# Altium schematic sheet PCB_Proyecto_Analoga.SchDoc
size A4; SheetNumber: 1; SheetTotal: 1
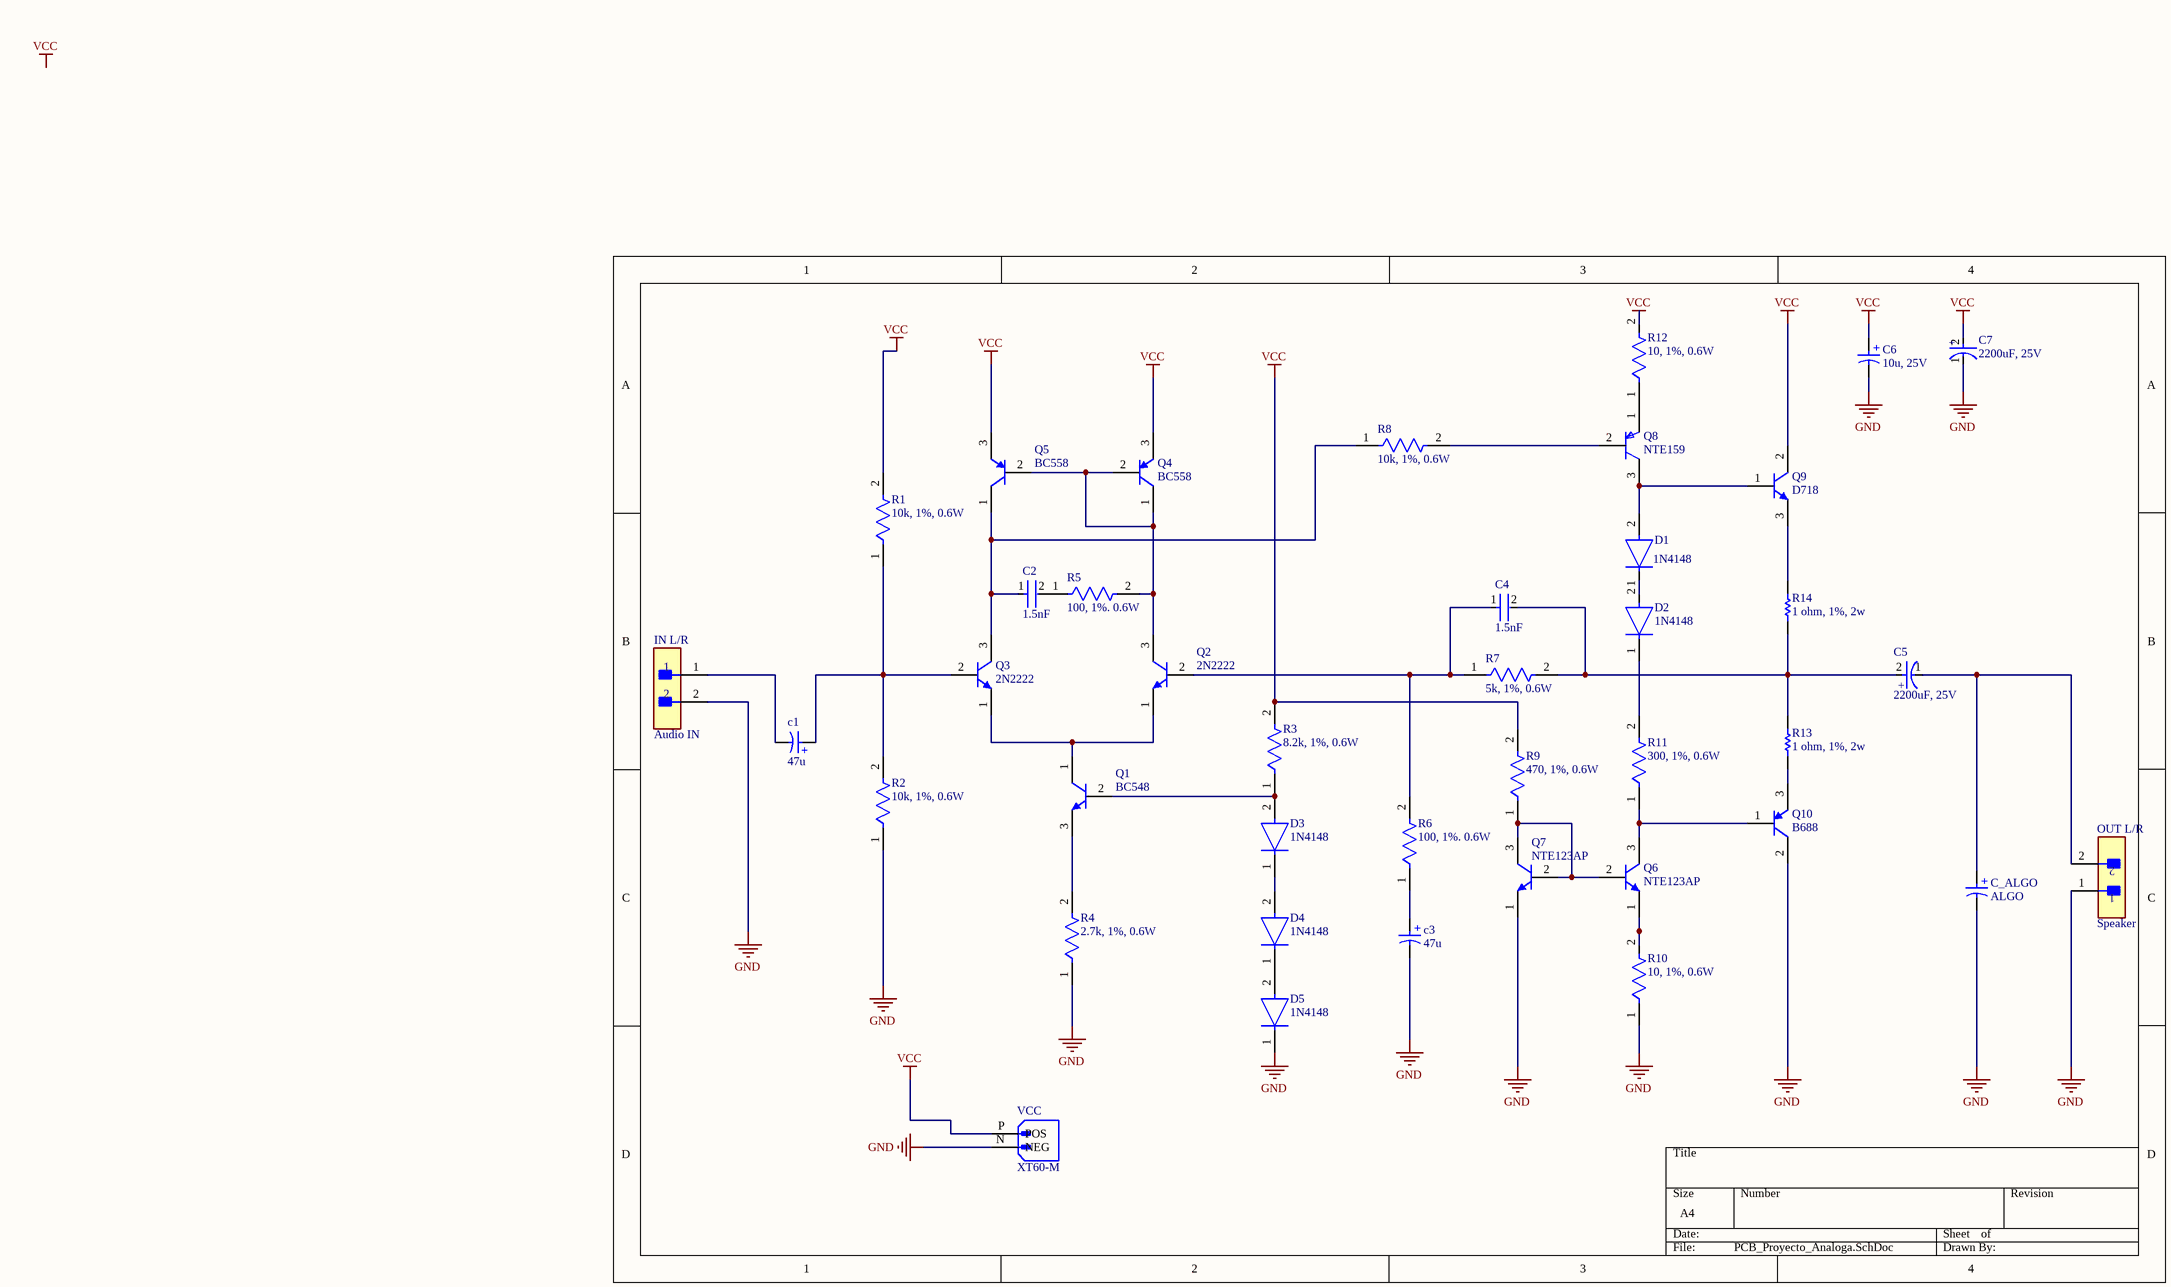
[diagram p0: PCB_Proyecto_Analoga.SchDoc]

## Parts
c1  47u  [WCAP-ATG5_D5H11]
C2  1.5nF  [FP-K105Z20Y5VF5TL2-MFG]
c3  47u  [WCAP-ATG5_D5H11]
C4  1.5nF  [FP-K105Z20Y5VF5TL2-MFG]
C5  2200uF, 25V  [FP-RAD-TH-D_12_5_0_5-L_35-MFG]
C6  10u, 25V  [WCAP-ATG5_D5H11]
C7  2200uF, 25V  [FP-RAD-TH-D_12_5_0_5-L_35-MFG]
C_ALGO  ALGO  [WCAP-ATG5_D5H11]
D1  1N4148  [FP-DO-35-MFG]
D2  1N4148  [FP-DO-35-MFG]
D3  1N4148  [FP-DO-35-MFG]
D4  1N4148  [FP-DO-35-MFG]
D5  1N4148  [FP-DO-35-MFG]
IN_L/R  Audio IN  [FP-22-28-8020-MFG]
OUT_L/R  Speaker  [FP-22-28-8020-MFG]
Q1  BC548  [ONSC-TO-92-3-29-11_AM_BL]
Q2  2N2222  [FAIR-TO-92-3]
Q3  2N2222  [FAIR-TO-92-3]
Q4  BC558  [ONSC-TO-92-3-29-11_AM_BL]
Q5  BC558  [ONSC-TO-92-3-29-11_AM_BL]
Q6  NTE123AP  [FAIR-TO-92-3]
Q7  NTE123AP  [FAIR-TO-92-3]
Q8  NTE159  [FP-135AR-MFG]
Q9  D718  [ONSC-TO-3P-3LD-3-340AB-01]
Q10  B688  [ONSC-TO-3P-3LD-3-340AB-01]
R1  10k, 1%, 0.6W  [FP-MF0207-MFG]
R2  10k, 1%, 0.6W  [FP-MF0207-MFG]
R3  8.2k, 1%, 0.6W  [FP-MRS25-MFG]
R4  2.7k, 1%, 0.6W  [FP-MF0207-MFG]
R5  100, 1%. 0.6W  [FP-MRS25-MFG]
R6  100, 1%. 0.6W  [FP-MRS25-MFG]
R7  5k, 1%, 0.6W  [FP-MF0207-MFG]
R8  10k, 1%, 0.6W  [FP-MF0207-MFG]
R9  470, 1%, 0.6W  [FP-MRS25-MFG]
R10  10, 1%, 0.6W  [FP-MRS25-MFG]
R11  300, 1%, 0.6W  [FP-MF0207-MFG]
R12  10, 1%, 0.6W  [FP-MRS25-MFG]
R13  1 ohm, 1%, 2w  [RESA86-1060X240]
R14  1 ohm, 1%, 2w  [RESA86-1060X240]
VCC  XT60-M  [AMASS_XT60-M]

## Nets
GND: c3.2(N) C6.2(N) C7.1(C) C_ALGO.2(N) D5.1(C) IN_L/R.2 OUT_L/R.1 Q7.1(E) Q10.2(C) R2.1 R4.1 R10.1 VCC.N(NEG)
VCC: C6.1(P) C7.2(A) Q4.3(E) Q5.3(E) Q9.2(C) R1.2 R3.2 R9.2 R12.2 VCC.P(POS)
Netc1_1: c1.1(P) Q3.2(B) R1.1 R2.2
Netc1_2: c1.2(N) IN_L/R.1
NetC2_1: C2.1 Q3.3(C) Q5.1(C) R8.1
NetC2_2: C2.2 R5.1
Netc3_1: c3.1(P) R6.1
NetC4_1: C4.1 Q2.2(B) R6.2 R7.1
NetC4_2: C4.2 C5.2(A) R7.2 R13.2 R14.1
NetC5_1: C5.1(C) C_ALGO.1(P) OUT_L/R.2
NetD1_1: D1.1(C) D2.2(A)
NetD1_2: D1.2(A) Q8.3(C) Q9.1(B)
NetD2_1: D2.1(C) R11.2
NetD3_1: D3.1(C) D4.2(A)
NetD3_2: D3.2(A) Q1.2(B) R3.1
NetD4_1: D4.1(C) D5.2(A)
NetQ1_1: Q1.1(C) Q2.1(E) Q3.1(E)
NetQ1_3: Q1.3(E) R4.2
NetQ2_3: Q2.3(C) Q4.1(C) Q4.2(B) Q5.2(B) R5.2
NetQ6_1: Q6.1(E) R10.2
NetQ6_2: Q6.2(B) Q7.2(B) Q7.3(C) R9.1
NetQ6_3: Q6.3(C) Q10.1(B) R11.1
NetQ8_1: Q8.1(E) R12.1
NetQ8_2: Q8.2(B) R8.2
NetQ9_3: Q9.3(E) R14.2
NetQ10_3: Q10.3(E) R13.1

## Notes on the sheet
- Labels drawn without touching a wire or pin: VCC
- (in symbol CMP-03913-53914185-1) +
- (in symbol CMP-05427-000597-1) +

## Library data of the parts
c1 c3 C_ALGO = CMP-03913-53914185-1: 860020472003 WCAP-ATG5 Aluminum Electrolytic Capacitors; Leakage Current: 3µA; Tolerance: 20%; Ripple Current: 38mA; Polarity: Polar; Voltage Rating: 25V; Pitch: 2mm; Capacitance: 10µF; Life (Hours): 2000hours; NexarPartId: 53914185; Min Operating Temperature: -40°C; Length: 11mm; Lead Pitch: 2.0066mm; Mount: Through Hole; Case/Package: Radial; RoHS: Compliant; Max Operating Temperature: 105°C; Diameter: 5mm; Packaging: Tape & Box (TB); Height - Seated (Max): 12.4968mm
C2 C4 = CMP-02417-000003-1: CAP CER 1UF 50V Y5V RADIAL; Manufacturer Part Number: K105Z20Y5VF5TL2; Manufacturer: Vishay BC Components; Tolerance: -20+80%; Material: Ceramic; Capacitance: 1uF; Temperature Characteristic: Y5V; Mouser Description: Multilayer Ceramic Capacitors MLCC - Leaded 1uF 50volts +80/-20% Y5V 2.5mm LS; Lead Free: Yes; RoHS: TRUE; Voltage Rating: 50V; Device Class L1: Passive Components; Octopart: https://octopart.com/k105z20y5vf5tl2-vishay-39475252; Temperature Range Low: -30°C; Digikey Description: CAP CER 1UF 50V Y5V RADIAL; Device Class L2: Capacitors; Temperature: -30°C to +85°C; Package: K105Z20Y5VF5TL2; Temperature Range High: +85°C; ComponentLink2Description: Datasheet; Value: 1uF; Category: Cap; Height: 6.6mm; ComponentLink2URL: https://www.vishay.com/docs/45171/kseries.pdf; Device Class L3: Ceramic Capacitors; Automotive: No
C5 C7 = CMP-05427-000597-1: Aluminum Electrolytic Capacitors (Radial Lead Type) AEC-Q200 Qualified 2200uF ±20% 25V; Lead Diameter: 0.8mm; Capacitance: 2.2mF; Leakage Current: 3uA; ESR (Equivalent Series Resistance): 22mR; Dielectric Material: Aluminium; Ripple Current: 2.51A; Life (Hours): 5000Hour; Termination: Radial; Voltage Rating: 25V; Package Quantity: 100; Lead Free: Lead Free; Contact Plating: Tin; Height - Seated (Max): 1.378inch; Mount: Through Hole; Height: 35mm; Max Operating Temperature: 105°C; Min Operating Temperature: -55°C; Voltage Rating (DC): 25V; Ratings: AEC-Q200; Packaging: Bulk; RoHS Compliant: Yes; Radiation Hardening: No; Lead Pitch: 5mm; Construction: RADIAL; Diameter: 12.5mm; Case/Package: Radial; REACH SVHC: No SVHC; Voltage: 25V; Tolerance: 20%; Impedance: 22mR; Length: 35mm; Series: FC
C6 = CMP-03913-53914185-1: 860020472003 WCAP-ATG5 Aluminum Electrolytic Capacitors; Leakage Current: 3µA; Tolerance: 20%; Ripple Current: 38mA; Polarity: Polar; Pitch: 2mm; Capacitance: 10µF; Life (Hours): 2000hours; NexarPartId: 53914185; Min Operating Temperature: -40°C; Length: 11mm; Lead Pitch: 2.0066mm; Mount: Through Hole; Voltage Rating: 25V; Case/Package: Radial; RoHS: Compliant; Max Operating Temperature: 105°C; Diameter: 5mm; Packaging: Tape & Box (TB); Height - Seated (Max): 12.4968mm
D1-D5 = CMP-06359-000016-1: DIODE GEN PURP 75V 200MA DO35
IN_L/R OUT_L/R = CMP-00257-00131383-2: 22-28-8020 Board Connector, 2 Contact(S), 1 Row(S), Male, Right Angle, 0.1 Inch Pitch, Solder Terminal,; NexarPartId: 131383; Manufacturer Lifecycle Status: ACTIVE; Voltage Rating: 250V; Number of Contacts: 2; Current Rating: 4A; Contact Resistance: 20mΩ; Max Voltage Rating (DC): 250.25kV; Glow Wire Compliant: Non-compliant; Pitch: 2.54mm; Plating: Tin; RoHS: Compliant; Lead Free: Lead Free; Termination: Through Hole; Height: 2.74mm; Contact Plating: Tin; Orientation: Right Angle; Min Operating Temperature: -40°C; Lifecycle Status: Production; Housing Material: Thermoplastic; Mount: Through Hole; Voltage Rating (DC): 250V; Gender: Male; Number of Rows: 1; Lead Pitch: 2.54mm; Packaging: Bulk; Number of Positions: 2; Flammability Rating: UL94 V-0; Number of Circuits: 2; Radiation Hardening: No; Housing Color: Black; Max Operating Temperature: 75°C; Color: Black; Contact Material: Brass; Country of Origin: US; REACH SVHC: Unknown
Q1 = CMP-1048-01603-1: Amplifier Transistor, NPN Silicon, 3-Pin TO-92, Pb-Free, Tape and Reel; Manufacturer: On Semiconductor; PartNumber: BC548BRL1G; fT Min (MHz): 150; IC Continuous (A): 0.1; ComponentLink3Description: Package Specification; ComponentLink1Description: Manufacturer URL; Packing: Tape and Reel; ComponentLink1URL: http://www.onsemi.com/; PackageReference: TO-92-3-29-11_AM_BL; Polarity: NPN; ComponentLink3URL: http://www.onsemi.com/pub_link/Collateral/MAC97-D.PDF; DatasheetVersion: Rev. 7; PackageDescription: 3-Pin Transistor Outline, Body 4.825 x 3.685 mm, Pitch 1.27 mm; ComponentLink2Description: Datasheet; Mounting Technology: Through Hole; PackageVersion: Rev. AM; RoHS: TRUE; ComponentLink2URL: http://www.onsemi.com/pub_link/Collateral/BC546-D.PDF
Q2 Q3 Q6 Q7 = CMP-2000-06911-1: NPN General-Purpose Amplifier, 40 V, -55 to 150 degC, 3-Pin TO-92, RoHS, Tape and Reel; Manufacturer: FairchildSemiconductor; Configuration: Single; Collector-Emitter Saturation Voltage: 1V; Collector- Emitter Voltage VCEO Max: 40V; Unit Weight: 0.008466oz; Maximum DC Collector Current: 1A; DC Collector/Base Gain hfe Min: 100; Emitter- Base Voltage VEBO: 6V; Maximum Power Dissipation: 625mW; DC Current Gain hFE Max: 300; Gain Bandwidth Product fT: 300MHz; Collector- Base Voltage VCBO: 75V; Mounting Style: ThroughHole; Package Description: 3-Pin Transistor Outline Package, Body Dia 4.79 mm, Pitch 2.6 mm; Mounting Technology: ThroughHole; RoHS: Details; Brand: FairchildSemiconductor; Minimum Operating Temperature: -55C; Package / Case: TO-92-3KinkedLead; Package Reference: TO-92; Series: PN2222; Packaging: Reel; Datasheet Version: Rev. 1.1.0, 07/2014; Datasheet URL: https://www.fairchildsemi.com/datasheets/PN/PN2222A.pdf; Maximum Operating Temperature: +150C; Transistor Polarity: NPN; Factory Pack Quantity: 2000; Manufacturer URL: https://www.fairchildsemi.com/; <PCN>: http://www.mouser.com/PCN/3.26.10LTBDFairchild.pdf; Product Category: BipolarTransistors-BJT
Q4 Q5 = CMP-1048-01513-1: Amplifier Transistor, PNP Silicon, 3-Pin TO-92, Pb-Free, Tape and Reel; Manufacturer: On Semiconductor; PartNumber: BC558BRL1G; IC Continuous (A): -0.1; ComponentLink1Description: Manufacturer URL; PackageReference: TO-92-3-29-11_AM_BL; ComponentLink3URL: http://www.onsemi.com/pub_link/Collateral/MAC97-D.PDF; ComponentLink1URL: http://www.onsemi.com/; Polarity: PNP; ComponentLink2Description: Datasheet; PackageDescription: 3-Pin Transistor Outline, Body 4.825 x 3.685 mm, Pitch 1.27 mm; ComponentLink2URL: http://www.onsemi.com/pub_link/Collateral/BC556B-D.PDF; DatasheetVersion: Rev. 3; ComponentLink3Description: Package Specification; Packing: Tape and Reel; RoHS: TRUE; Mounting Technology: Through Hole; PackageVersion: Rev. AM
Q8 = CMP-00278-84408866-1: 2N3906TF Small Signal Bipolar Transistor, 0.2A I(C), 40V V(BR)CEO, 1-Element, PNP, Silicon, TO-92; Manufacturer Lifecycle Status: ACTIVE; Collector Base Voltage (VCBO): -40V; Frequency: 250MHz; Number of Elements: 1; Max Power Dissipation: 625mW; Max Breakdown Voltage: 160V; Current Rating: -200mA; Emitter Base Voltage (VEBO): -5V; Collector Emitter Saturation Voltage: -400mV; Element Configuration: Single; Max Junction Temperature (Tj): 150°C; hFE Min: 100; Polarity: PNP; Lead Free: Lead Free; RoHS: Compliant; Max Operating Temperature: 150°C; Collector Emitter Voltage (VCEO): -40V; Max Frequency: 250MHz; Power Dissipation: 625mW; Height: 5.33mm; Schedule B: 8541210080; Mount: Through Hole; Length: 5.2mm; REACH SVHC: No SVHC; Min Operating Temperature: -55°C; Gain Bandwidth Product: 250MHz; Number of Pins: 3; Lifecycle Status: Production; Transition Frequency: 250MHz; NexarPartId: 84408866; Collector Emitter Breakdown Voltage: -40V; Case/Package: TO-92; Packaging: Tape and Reel; Width: 4.19mm; Max Collector Current: -200mA; Radiation Hardening: No; Weight: 240mg; Voltage Rating (DC): -40V
Q9 = CMP-1046-00123-1: Complementary NPN Silicon Power Bipolar Transistor, 3-Pin TO-3P-3LD, Pb-Free, Tube; PartNumber: NJW3281G; Manufacturer: On Semiconductor; IC Continuous (A): 15; hFE Max: 150; ComponentLink1Description: Manufacturer URL; Mounting Technology: Through Hole; ComponentLink1URL: http://www.onsemi.com/; RoHS: TRUE; PackageReference: TO-3P-3LD-3-340AB-01; DatasheetVersion: Rev. 1; Polarity: NPN; ComponentLink3Description: Package Specification; PackageDescription: 3-Pin Flange Mount, Vertical Straight Lead, Body 15.6 x 4.8 mm, Pitch 5.45 mm; Packing: Tube; PackageVersion: Rev. A, 10/2007; ComponentLink2URL: http://www.onsemi.com/pub_link/Collateral/NJW3281-D.PDF; ComponentLink3URL: http://www.onsemi.com/pub_link/Collateral/340AB.PDF; ComponentLink2Description: Datasheet
Q10 = CMP-1030-00027-1: Complementary PNP Silicon Power Bipolar Transistor, 3-Pin TO-3P-3LD, Pb-Free, Tube; PartNumber: NJW1302G; Manufacturer: On Semiconductor; hFE Max: 150; IC Continuous (A): 15; PackageDescription: 3-Pin Flange Mount, Vertical Straight Lead, Body 15.6 x 4.8 mm, Pitch 5.45 mm; PackageReference: TO-3P-3LD-3-340AB-01; ComponentLink3Description: Package Specification; Packing: Tube; PackageVersion: Rev. A, 10/2007; ComponentLink1URL: http://www.onsemi.com/; ComponentLink2URL: http://www.onsemi.com/pub_link/Collateral/NJW3281-D.PDF; ComponentLink1Description: Manufacturer URL; DatasheetVersion: Rev. 1; ComponentLink2Description: Datasheet; Mounting Technology: Through Hole; ComponentLink3URL: http://www.onsemi.com/pub_link/Collateral/340AB.PDF; RoHS: TRUE; Polarity: PNP
R1 R2 R4 R7 R8 R11 = CMP-03413-000006-1: RES 10K OHM 1% 0.6W AXIAL; Temperature Coefficient: 50ppm/°C; Resistance: 10kR; Mount: Through Hole; Radiation Hardening: No; Tolerance: 1%; Construction: Cylindrical; Contact Plating: Tin; Case/Package: Conformal; Resistor Type: Metal Film; Min Operating Temperature: -55°C; Military Standard: Not; Lead Free: Lead Free; Diameter: 2.4mm; Termination: Axial; Max Operating Temperature: 155°C; RoHS Compliant: Yes; Packaging: Ammo Pack; Length: 6.3mm
R3 = CMP-02408-000049-1: RES 953 OHM 0.6W 1% AXIAL; Power Rating: 600mW; Voltage Rating: 350V; Resistance: 953R; Temperature Coefficient: 50ppm/°C; Lead Length: 26mm; Case/Package: Axial; Max Power Dissipation: 600mW; Series: MRS25; Resistance Tolerance: 1%; Packaging: Tape and Reel; Radiation Hardening: No; Min Operating Temperature: -55°C; Contact Plating: Tin; Max Operating Temperature: 155°C; Length: 6.5mm; Number of Terminations: 2; Width: 2.5mm; Construction: Cylindrical; Termination: Axial; RoHS Compliant: Yes; Lead Free: Lead Free; Military Standard: Not; Technology: THIN FILM; Diameter: 2.5mm; Tolerance: 1%; Resistor Type: Metal Film
R5 R6 R10 R12 = CMP-00030-42757237-1: MRS25000C1000FRP00 Resistor, 100 Ohm, ± 1%, 600 mW, Axial Leaded, Metal Film (Thin Film), Professional; Max Power Dissipation: 600mW; Resistance: 100Ω; Voltage Rating: 350V; Temperature Coefficient: 50ppm/°C; Lead Diameter: 600µm; RoHS: Compliant; Radiation Hardening: No; Schedule B: 8533210090, 8533210090; Length: 6.5mm; Packaging: Tape & Reel (TR); Number of Terminations: 2; Mount: Through Hole; Width: 2.5mm; Tolerance: 1%; Military Standard: Not; Voltage Rating (DC): 350V; Contact Plating: Tin; Number of Pins: 2; Max Operating Temperature: 155°C; NexarPartId: 42757237; Diameter: 2.5mm; Composition: Metal Film, Thin Film; REACH SVHC: Unknown; Power Rating: 600mW; Lead Free: Lead Free; Termination: Axial; Case/Package: Axial; Min Operating Temperature: -55°C
R9 = CMP-02408-000051-1: RES 1K OHM 0.6W 1% AXIAL; Power Rating: 600mW; Lead Diameter: 0.6mm; Voltage Rating (DC): 350V; Resistance: 1kR; Temperature Coefficient: 50ppm/°C; Width: 2.5mm; Military Standard: Not; Package Quantity: 5000; Radiation Hardening: No; Case/Package: Axial; Resistance Tolerance: 1%; Resistor Type: Metal Film; Contact Plating: Tin; Length: 6.5mm; Lead Free: Lead Free; RoHS Compliant: Yes; Mount: Through Hole; Number of Pins: 2; Technology: THIN FILM; Voltage Rating: 350V; Min Operating Temperature: -55°C; Weight: 0.00776oz; Diameter: 2.5mm; Construction: Cylindrical; Series: MRS25; Tolerance: 1%; Packaging: Tape and Reel; Max Operating Temperature: 155°C; Max Power Dissipation: 600mW; Number of Terminations: 2; Termination: Axial
R13 R14 = CMP-1678-00005-1: Axial Resistor, 50 mOhm, +/- 1%, 2 W, -55 to 275 degC, 2-Pin THD, RoHS, Bulk; Bandwidth: 700 KHz; Nominal Supply Voltage: 12 V; Min Dual Supply Voltage: 1.5 V; Output Current: 30 mA; Max Dual Supply Voltage: 16 V; Case\Package: SOIC; Slew Rate: 0.3 V\us; Nominal Voltage Gain: 100 dB; Nominal Supply Current: 1.2 mA; Common Mode Rejection Ratio: 65 dB; Channels: 2; Radiation Hardening: No; Unity Gain Bandwidth Product: 700 KHz; Pins: 8; RoHSCompliant: true; ComponentLink2Description: Datasheet; Nominal Gain Bandwith Product: 700 KHz; Package Quantity: 1; PackageReference: 12FR050E; Min Operating Temperature: 0 degC; PackageDescription: 2-Pin Axial Lead, Dia 2.4 mm, Body Length 10.6 mm; Packaging: Cut Tape; Mount: Surface Mount; Nominal Dual Supply Voltage: 12 V; Min Supply Voltage: 1.5 V; Max Supply Voltage: 16 V; DatasheetVersion: Jun-15; ComponentLink1Description: Manufacturer URL; Max Operating Temperature: 70 degC; ComponentLink1URL: http://www.ohmite.com/; REACH SVHC: No SVHC; ComponentLink2URL: http://www.ohmite.com/cat/res_10.pdf; Height: 1.58 mm; Width: 3.91 mm; Length: 4.9 mm
VCC = CMP-245-000000-3: Plug; DC supply; XT60; male; PIN: 2; for cable; soldered; 30A; 500V; MF: AMASS; Price: None; SnapEDA_Link: https://www.snapeda.com/parts/XT60-M/AMASS/view-part/?ref=snap; Value: *; MP: XT60-M; Check_prices: https://www.snapeda.com/parts/XT60-M/AMASS/view-part/?ref=eda; Package: Package; Design Item ID: XT60-M; Component Type: Standard; Availability: Not in stock; Source: XT60-M.SchLib; Pin Count: 2